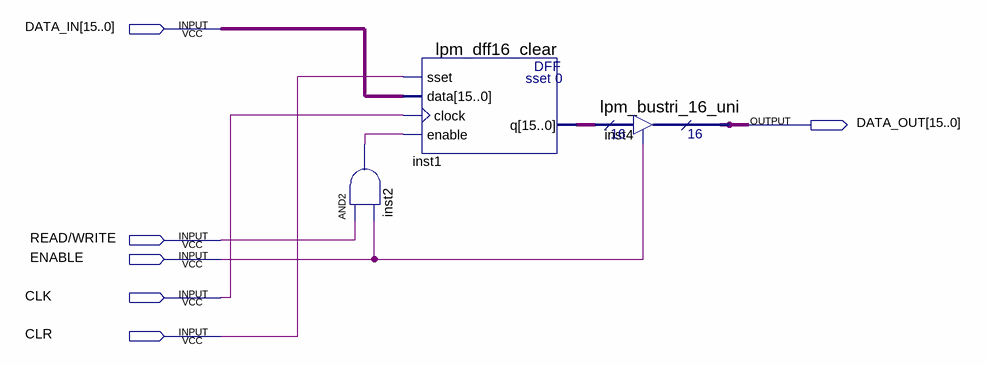
[diagram p0: schematic sheet]
// Quartus schematic register16_clear.bdf as structural Verilog: 3 symbols, 6 pins
module register16_clear (
  input  [15:0] DATA_IN,
  input  \READ/WRITE ,
  input  ENABLE,
  input  CLK,
  input  CLR,
  output [15:0] DATA_OUT
);

  wire inst2_out;
  wire [15:0] inst1_q;

  and inst2 (inst2_out, \READ/WRITE , ENABLE);
  lpm_dff16_clear inst1 (.sset(CLR), .data(DATA_IN), .clock(CLK), .enable(inst2_out), .q(inst1_q));
  lpm_bustri_16_uni inst4 (.enabledt(ENABLE), .data(inst1_q), .tridata(DATA_OUT));
endmodule
